# EAGLE design TransformerBoard (EAGLE 6.6.0)
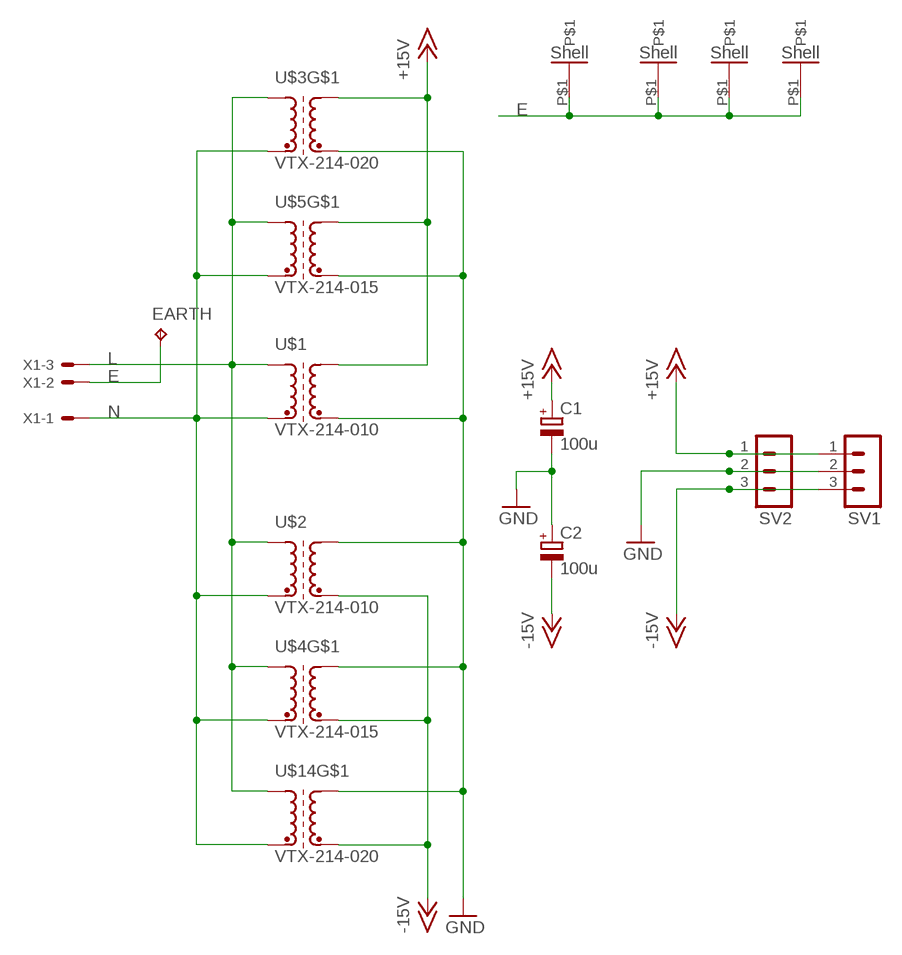
[diagram p0: schematic, sheet 1]

## Parts
C1  100u  CPOL-EUE5-8.5  [E5-8,5]
C2  100u  CPOL-EUE5-8.5  [E5-8,5]
EARTH  TPPAD1-17  [P1-17]
SV1  MA03-1  [MA03-1]
SV2  MA03-1  [MA03-1]
U$1  VTX-214-010  [VTX-214-010]
U$2  VTX-214-010  [VTX-214-010]
U$3  VTX-214-020  [VTX-214-020]
U$4  VTX-214-015  [VTX-214-015]
U$5  VTX-214-015  [VTX-214-015]
U$14  VTX-214-020  [VTX-214-020]
X1  KK-156-3  [KK-156-3]

## Nets
+15V: C1.+ SV1.1 SV2.1 U$1.P$3(A2) U$3.P$4(A2) U$5.P$4(A2)
-15V: C2.- SV1.3 SV2.3 U$2.P$4(E2) U$4.P$5(E2) U$14.P$5(E2)
E: EARTH.TP U$3.P$1 U$4.P$1 U$5.P$1 U$14.P$1 X1.2
GND: C1.- C2.+ SV1.2 SV2.2 U$1.P$4(E2) U$2.P$3(A2) U$3.P$5(E2) U$4.P$4(A2) U$5.P$5(E2) U$14.P$4(A2)
L: U$1.P$1(A1) U$2.P$1(A1) U$3.P$3(A1) U$4.P$3(A1) U$5.P$3(A1) U$14.P$3(A1) X1.3
N: U$1.P$2(E1) U$2.P$2(E1) U$3.P$2(E1) U$4.P$2(E1) U$5.P$2(E1) U$14.P$2(E1) X1.1

## Library data of the parts
C1 C2 = rcl:CPOL-EU: POLARIZED CAPACITOR, European symbol
EARTH = testpad:TP: Test pad
SV1 SV2 = con-lstb:MA03-1: PIN HEADER; OC_FARNELL: unknown; OC_NEWARK: unknown
U$1 U$2 = Rebel:VTX-214-010
U$3 U$14 = Rebel:VTX-214-020
U$4 U$5 = Rebel:VTX-214-015
X1 = con-molex:KK-156-3: KK 156 HEADER Source: http://www.molex.com/pdm_docs/sd/026604100_sd.pdf; OC_FARNELL: unknown; OC_NEWARK: unknown

## Board
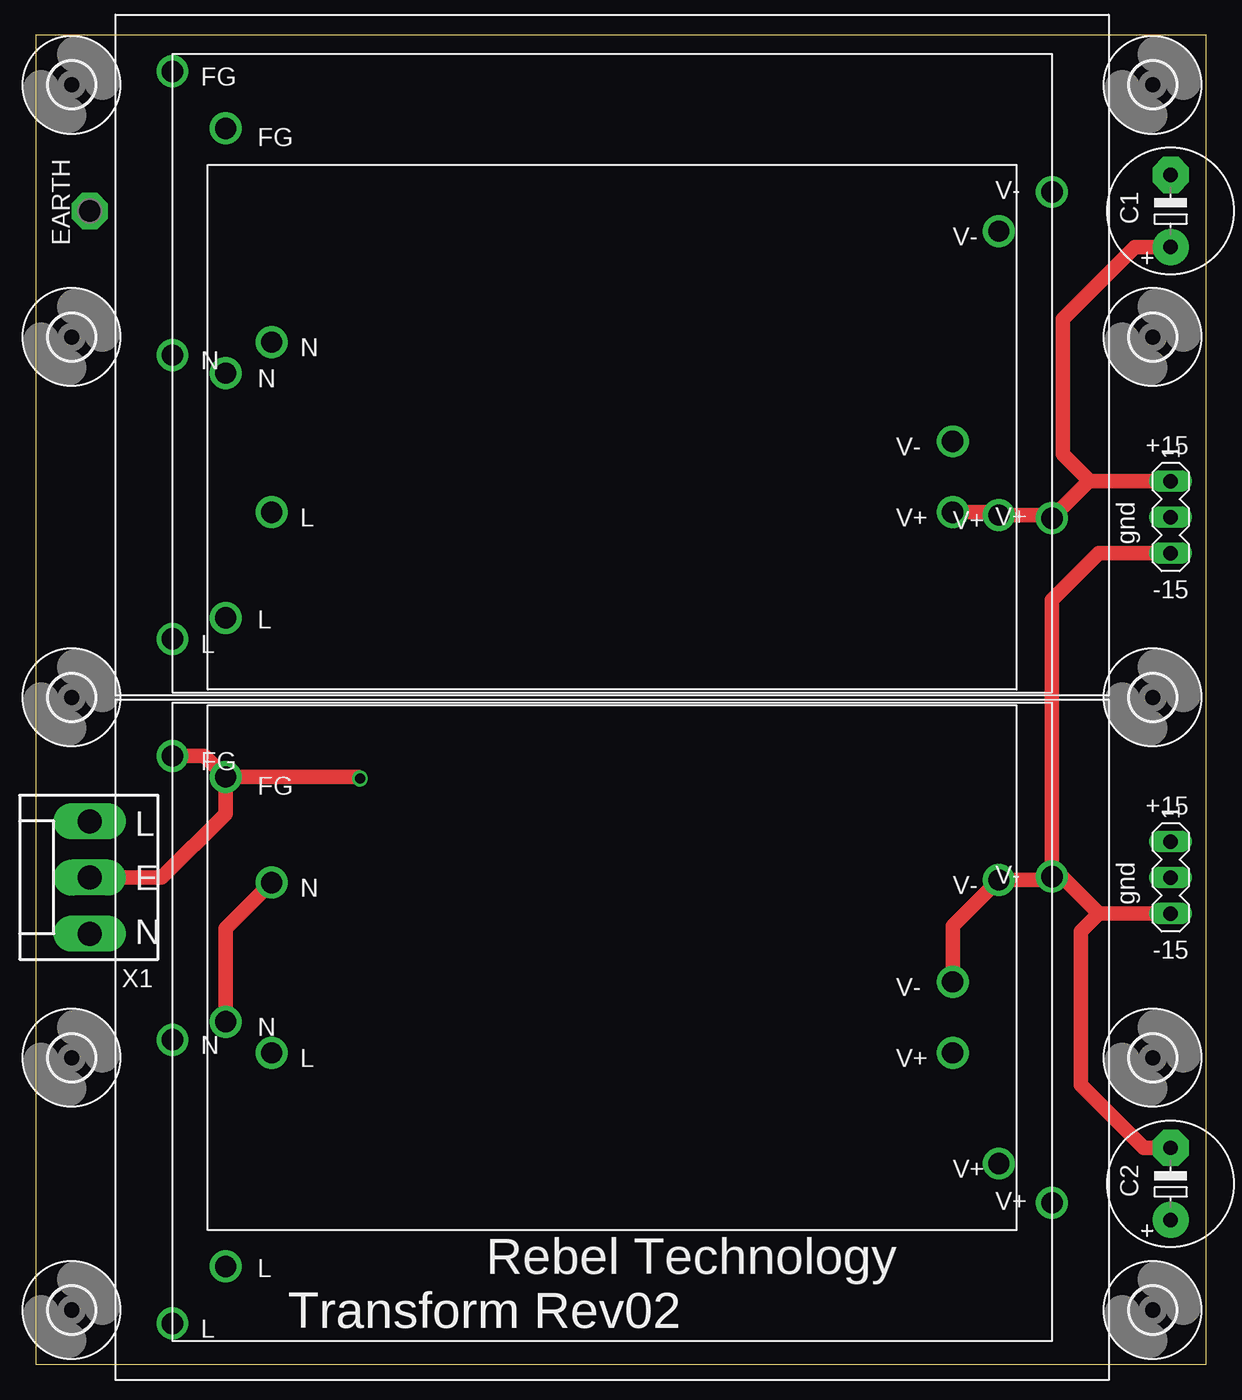
[diagram p1: board, top side]
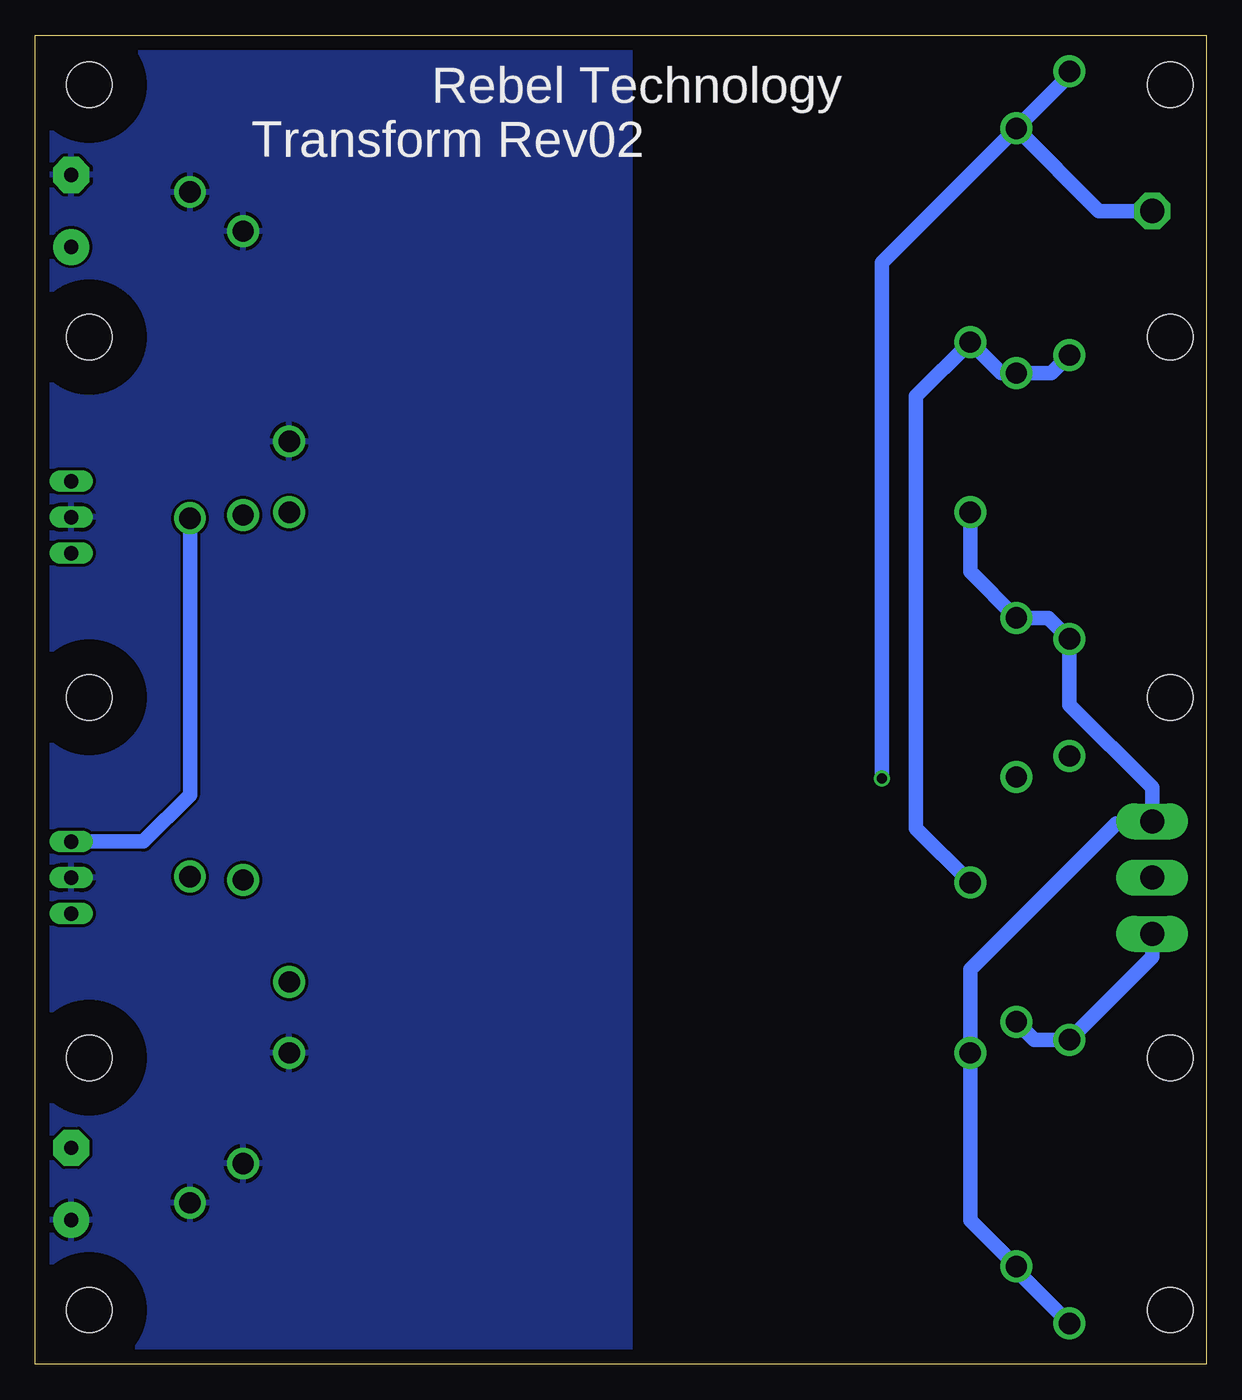
[diagram p2: board, bottom side, seen from below]

Size 82.53 x 93.65 mm. Coordinates in mm from the lower left corner, seen from the top.
Outline: 0,0 82.53,0 82.53,93.65 0,93.65 0,0
Copper layers (1*16): Top 0.035mm / dielectric 1.5mm / Bottom 0.035mm
Design rules "default": minimum track width 10mil, minimum drill 24mil, track to track 8mil, track to pad 8mil, pad to pad 8mil, via to via 8mil, smd to smd 8mil, copper to edge 40mil, drill to drill 8mil, minimum pad ring 10mil, minimum via ring 8mil, stop-mask expansion 4mil, vias tented up to drill 0mil, thermal gap 10mil

### Footprints (pad centres in the part's own frame; a part is rotated, then mirrored left to right if it is on the bottom)
E5-8,5 = drill 1.016 pad 2.54: + -2.54,0 | drill 1.016 pad 2.54 octagon: - 2.54,0
P1-17 = drill 1.702 pad 2.54 octagon: TP 0,0
MA03-1 = drill 1.016 long: 1 -2.54,0; 2 0,0; 3 2.54,0
VTX-214-010 = drill 1.5: P$1 -24,-6; P$2 -24,6; P$3 24,-6; P$4 24,-1
VTX-214-020 = drill 1.5: P$1 -31,20; P$2 -31,0; P$3 -31,-20; P$4 31,-11.5; P$5 31,11.5
VTX-214-015 = drill 1.5: P$1 -27.25,17.25; P$2 -27.25,0; P$3 -27.25,-17.25; P$4 27.25,-10; P$5 27.25,10
3,2 = hole 3.2: 0,0
KK-156-3 = drill 1.7 pad 2.184 long: 1 -3.96,0; 2 0,0; 3 3.96,0

### Placement (x,y rotation side)
C1  80.01,81.28 90 top
C2  80.01,12.7 90 top
EARTH  3.81,81.28 90 top
SV1  80.01,34.29 270 top
SV2  80.01,59.69 270 top
U$1  40.64,66.04 0 top
U$2  40.64,27.94 0 top
U$3  40.64,71.12 0 top
U$4  40.64,24.13 0 top
U$5  40.64,69.85 0 top
U$6  [3,2]  2.54,3.81 0 top
U$7  [3,2]  2.54,21.59 0 top
U$8  [3,2]  78.74,3.81 0 top
U$9  [3,2]  78.74,90.17 0 top
U$10  [3,2]  78.74,46.99 0 top
U$11  [3,2]  2.54,46.99 0 top
U$12  [3,2]  78.74,72.39 0 top
U$13  [3,2]  78.74,21.59 0 top
U$14  40.64,22.86 0 top
U$15  [3,2]  2.54,72.39 0 top
U$16  [3,2]  2.54,90.17 0 top
X1  3.81,34.29 90 top

### Tracks (layer width: path | path; a pad name or v marks a point on that pad's centre or on a via)
+15V
  Top 1.016: U$1.P$3 67.7,60.04 U$5.P$4 71.41,59.85 U$3.P$4 74.25,62.23 74.3,62.23 | SV2.1 74.3,62.23 | C1.+ 77.47,78.74 72.39,73.66 72.39,64.14 74.3,62.23
  Bottom 1.016: U$3.P$4 71.64,40.12 74.93,36.83 SV1.1
-15V
  Top 1.016: U$2.P$4 64.64,30.88 U$4.P$5 71.41,34.13 U$14.P$5 | C2.- 78.11,15.24 73.66,19.68 73.66,30.48 74.93,31.75 | U$14.P$5 72.32,34.36 74.93,31.75 | 74.93,31.75 SV1.3 | U$14.P$5 71.64,53.86 74.93,57.15 SV2.3
E  (via drill 0.7)
  Top 1.016: X1.2 8.89,34.29 13.39,38.79 U$4.P$1 | U$14.P$1 11.91,42.86 U$4.P$1 | U$4.P$1 22.75,41.38 v22.86,41.27
  Bottom 1.016: v22.86,41.27 22.86,77.63 U$5.P$1 | EARTH.TP 7.57,81.28 U$5.P$1 | U$3.P$1 9.64,90.85 U$5.P$1
GND
  pour Bottom: 40.64,97.79 40.64,-2.54 83.82,-2.54 83.82,97.79
L
  Bottom 1.016: U$1.P$1 16.64,55.85 U$5.P$3 11.12,52.6 U$3.P$3 9.64,46.47 3.81,40.64 X1.3 3.96,38.1 6.35,38.1 16.64,27.81 U$2.P$1 16.64,10.13 U$4.P$3 13.39,6.61 U$14.P$3
N
  Top 1.016: U$4.P$2 13.39,30.69 U$2.P$2
  Bottom 1.016: U$3.P$2 10.91,69.85 U$5.P$2 14.45,69.85 U$1.P$2 20.45,68.23 20.45,37.75 U$2.P$2 | X1.1 3.81,28.69 U$14.P$2 12.12,22.86 U$4.P$2

### Text on the board
tPlace: +15 | gnd | -15 | +15 | L | E | gnd | N | -15 | Rebel Technology | Transform Rev02
bPlace: Rebel Technology | Transform Rev02